# Altium project SheildBoard.PrjPcb
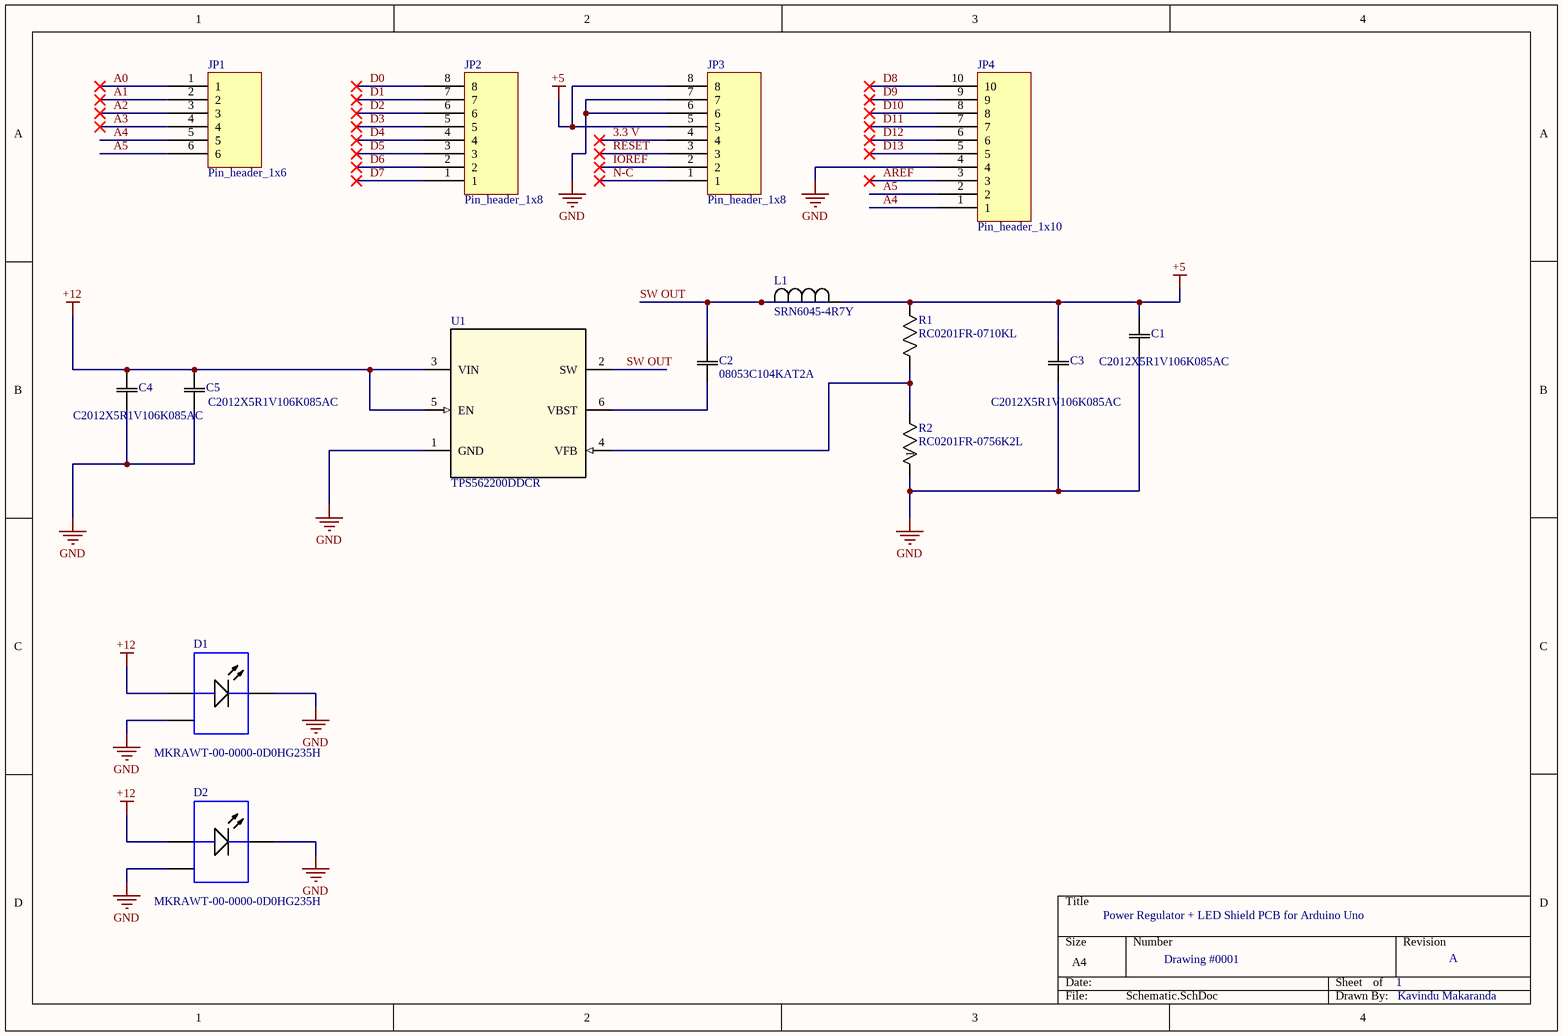
[diagram p0: Schematic.SchDoc]
1 sheet, 15 parts. Net scope: global (net labels, ports and power ports of the same name join across sheets).
Board file: PCB.PcbDoc

## Sheet Schematic.SchDoc: Power Regulator + LED Shield PCB for Arduino Uno
size A4; DrawnBy: Kavindu Makaranda; DocumentNumber: Drawing #0001; Revision: A; SheetNumber: 1; SheetTotal: 1

### Parts
C1  C2012X5R1V106K085AC  [6-0805_N]
C2  08053C104KAT2A  [6-0805_N]
C3  C2012X5R1V106K085AC  [6-0805_M]
C4  C2012X5R1V106K085AC  [6-0805_M]
C5  C2012X5R1V106K085AC  [6-0805_M]
D1  MKRAWT-00-0000-0D0HG235H  [CREE-MK-R-2_V]
D2  MKRAWT-00-0000-0D0HG235H  [CREE-MK-R-2_V]
JP1  Pin_header_1x6  [Pin_header_1x6]
JP2  Pin_header_1x8  [Pin_header_1x8]
JP3  Pin_header_1x8  [Pin_header_1x8]
JP4  Pin_header_1x10  [Pin_header_1x10]
L1  SRN6045-4R7Y  [SRN6045-4R7Y]
R1  RC0201FR-0710KL  [0603]
R2  RC0201FR-0756K2L  [0603]
U1  TPS562200DDCR  [TPS562200DDCR]

### Nets
+5: C1.2 C3.2 JP3.5 JP3.8 L1.1 R1.2
+12: C4.2 C5.2 D1.1(A) D2.1(A) U1.3(VIN) U1.5(EN)
GND: C1.1 C3.1 C4.1 C5.1 D1.2(K) D1.3(EP) D2.2(K) D2.3(EP) JP3.6 JP3.7 JP4.4 R2.1 U1.1(GND)
3.3 V: JP3.4
A0: JP1.1
A1: JP1.2
A2: JP1.3
A3: JP1.4
A4: JP1.5 JP4.1
A5: JP1.6 JP4.2
AREF: JP4.3
D0: JP2.8
D1: JP2.7
D2: JP2.6
D3: JP2.5
D4: JP2.4
D5: JP2.3
D6: JP2.2
D7: JP2.1
D8: JP4.10
D9: JP4.9
D10: JP4.8
D11: JP4.7
D12: JP4.6
D13: JP4.5
IOREF: JP3.2
N-C: JP3.1
RESET: JP3.3
SW OUT: C2.2 L1.2 U1.2(SW)
NetC2_1: C2.1 U1.6(VBST)
NetR1_1: R1.1 R2.2 U1.4(VFB)

### Library data of the parts
C1 C3-C5 = C2012X5R1V106K085AC: Mfr_Name: TDK; Supplier 1: Digikey; Supplier Part Number 1: 445-14417-1-ND
C2 = 08053C104KAT2A: Mfr_Name: KYOCERA AVX; Supplier 1: Avnet; Supplier Part Number 1: 96M1381
D1 D2 = CMP-2100-00977-1: LED, White, 12 V, 2-Pin SMD, RoHS, Tape and Reel
L1 = SRN6045-4R7Y: No Description Available; Mfr_Name: Bourns Electronics
R1 = RC0201FR-0710KL: Mfr_Name: Yageo; Supplier 1: Future Electronics; Supplier Part Number 1: 4031233
R2 = RC0201FR-0756K2L: No Description Available; Mfr_Name: Yageo; Type: Chip Resistor - Surface Mount; Supplier 1: Future Electronics; Supplier Part Number 1: 5109860
U1 = TPS562200DDCR: No Description Available; Mfr_Name: Texas Instruments; Alternate_Manufacturer: None; CurrentTime: Not shown in title block; DocumentNumber: 1; SymbolCreator: a0411947; CompType: IC; U/M: EA; Designator: U?; CurrentDate: Not shown in title block; Time: Not shown in title block; Date: Not shown in title block; DocumentFullPathAndName: Not shown in title block; DocumentName: Not shown in title block; ModifiedDate: Not shown in title block; ApprovedBy: Not shown in title block; CheckedBy: Not shown in title block; Author: Not shown in title block; CompanyName: Not shown in title block; Engineer: Not shown in title block; Organization: Not shown in title block; Address1: Not shown in title block; Address2: Not shown in title block; Address3: Not shown in title block; Address4: Not shown in title block; Revision: Use project parameter SCH_Rev; SheetNumber: 1; SheetTotal: 1; ImagePath: Not shown in title block; Rule: *; ProjectName: *; SymbolVersion: 2013-09-26; PartNumber: TPS562200DDC; PackageReference: DDC0006A; MountType: SMT; ComponentLink1Description: Datasheet Link; ComponentLink1URL: https://sps06.itg.ti.com/sites/KMS/crossdivteams/altium/docs/ComponentDatasheets/TPS562200_DS_v08_13_0909.docx; RoHS: Y; Publisher: Texas Instruments; LatestRevisionDate: 2014-02-20; Manufacturer: Texas Instruments; RefDes: Refdes; Type: Type; Supplier 1: Mouser; Supplier Part Number 1: 595-TPS562200DDCR